# Altium schematic sheet IMX273.SchDoc
size A2; Organization: Altium Limited; Address1: L3, 12a Rodborough Rd; Address2: Frenchs Forest; Address3: NSW; Address4: Australia 2086
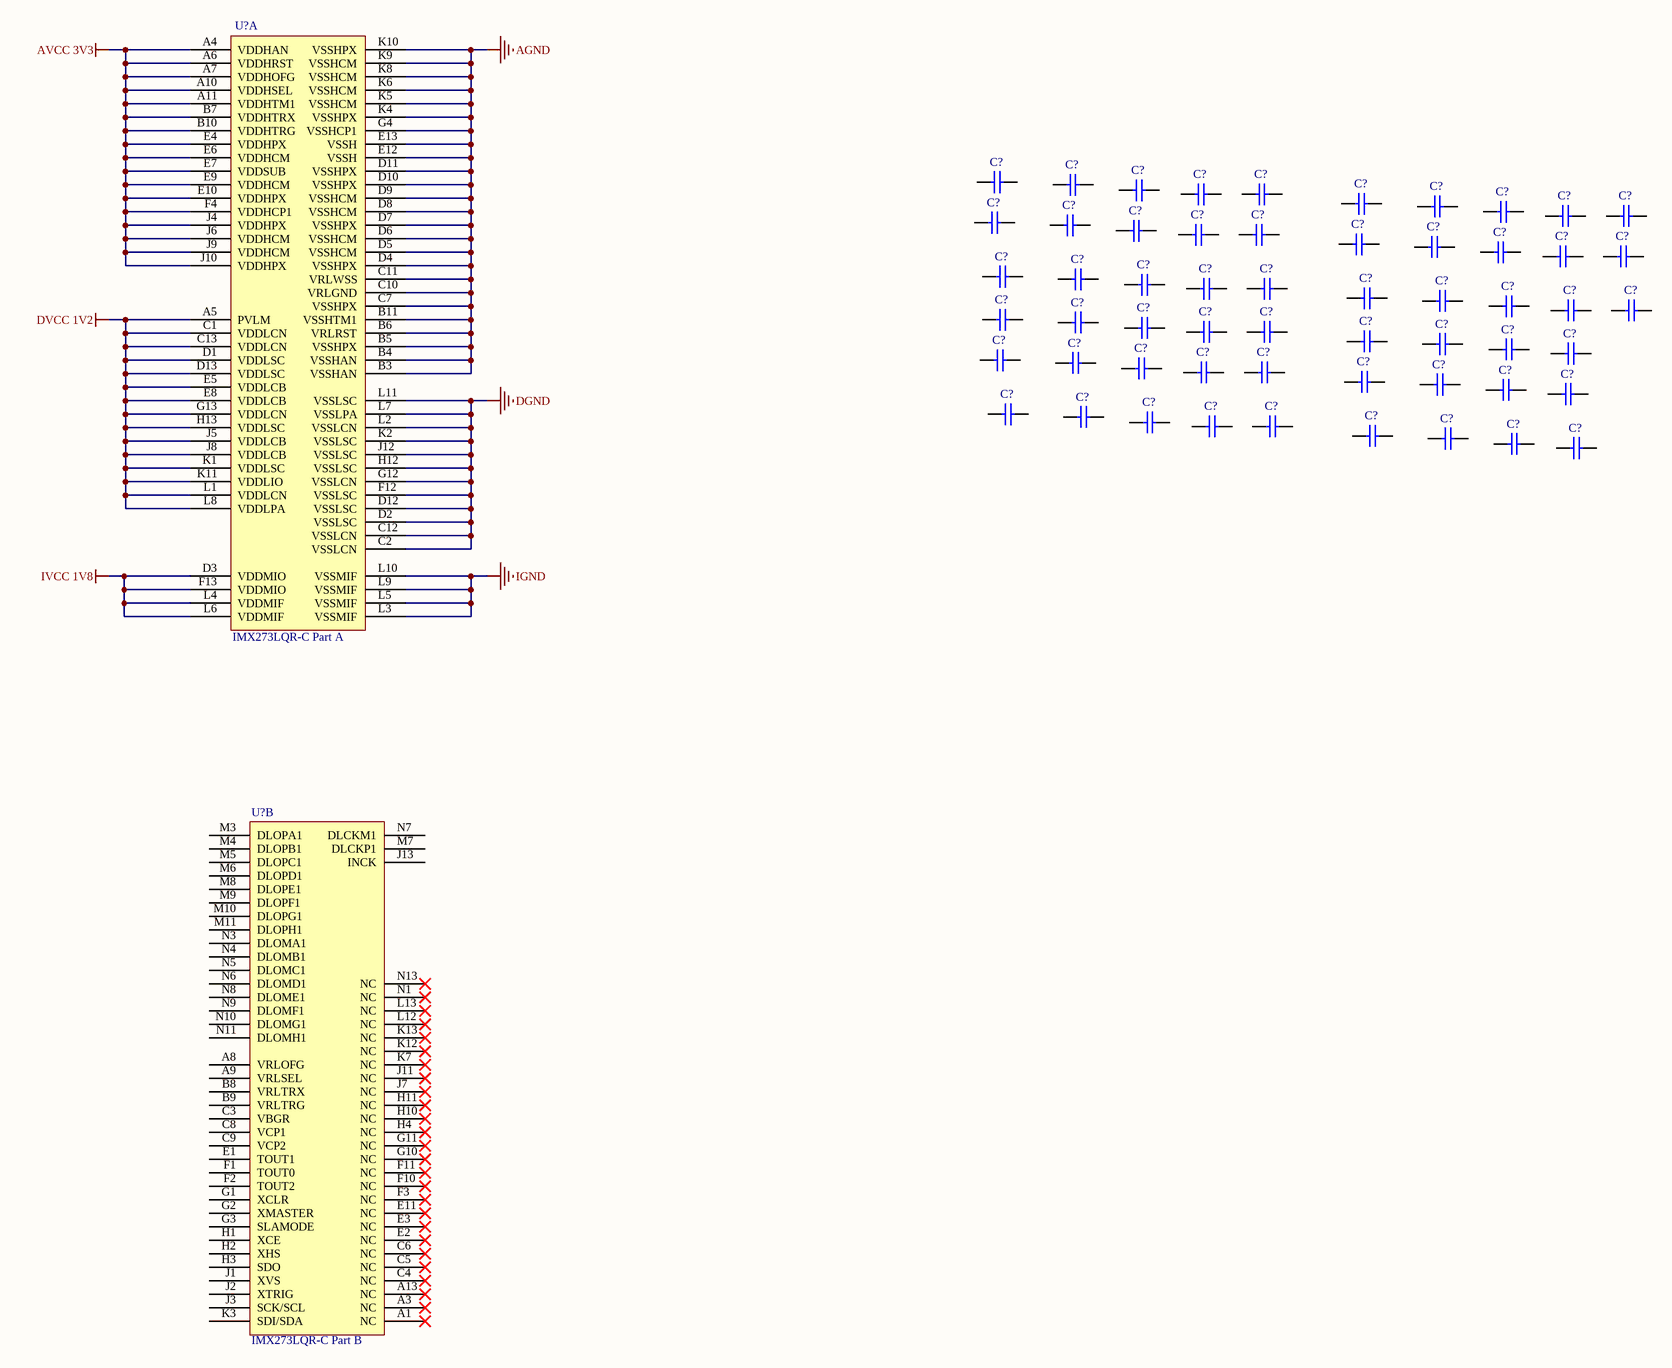
[diagram p0: IMX273.SchDoc]

## Parts
(Parts that share a designator on the sheet are numbered #1, #2 ... from top to bottom, then left to right.)
C?#1  CL05A106MQ5NUNC  [0402_C]  (value not drawn)
C?#2  CL05A106MQ5NUNC  [0402_C]  (value not drawn)
C?#3  CL05A106MQ5NUNC  [0402_C]  (value not drawn)
C?#4  CL05A106MQ5NUNC  [0402_C]  (value not drawn)
C?#5  CL05A106MQ5NUNC  [0402_C]  (value not drawn)
C?#6  CL05A106MQ5NUNC  [0402_C]  (value not drawn)
C?#7  CL05A106MQ5NUNC  [0402_C]  (value not drawn)
C?#8  CL05A106MQ5NUNC  [0402_C]  (value not drawn)
C?#9  CL05A106MQ5NUNC  [0402_C]  (value not drawn)
C?#10  CL05A106MQ5NUNC  [0402_C]  (value not drawn)
C?#11  CL05A106MQ5NUNC  [0402_C]  (value not drawn)
C?#12  CL05A106MQ5NUNC  [0402_C]  (value not drawn)
C?#13  CL05A106MQ5NUNC  [0402_C]  (value not drawn)
C?#14  CL05A106MQ5NUNC  [0402_C]  (value not drawn)
C?#15  CL05A106MQ5NUNC  [0402_C]  (value not drawn)
C?#16  CL05A106MQ5NUNC  [0402_C]  (value not drawn)
C?#17  CL05A106MQ5NUNC  [0402_C]  (value not drawn)
C?#18  CL05A106MQ5NUNC  [0402_C]  (value not drawn)
C?#19  CL05A106MQ5NUNC  [0402_C]  (value not drawn)
C?#20  CL05A106MQ5NUNC  [0402_C]  (value not drawn)
C?#21  CL05A106MQ5NUNC  [0402_C]  (value not drawn)
C?#22  CL05A106MQ5NUNC  [0402_C]  (value not drawn)
C?#23  CL05A106MQ5NUNC  [0402_C]  (value not drawn)
C?#24  CL05A106MQ5NUNC  [0402_C]  (value not drawn)
C?#25  CL05A106MQ5NUNC  [0402_C]  (value not drawn)
C?#26  CL05A106MQ5NUNC  [0402_C]  (value not drawn)
C?#27  CL05A106MQ5NUNC  [0402_C]  (value not drawn)
C?#28  CL05A106MQ5NUNC  [0402_C]  (value not drawn)
C?#29  CL05A106MQ5NUNC  [0402_C]  (value not drawn)
C?#30  CL05A106MQ5NUNC  [0402_C]  (value not drawn)
C?#31  CL05A106MQ5NUNC  [0402_C]  (value not drawn)
C?#32  CL05A106MQ5NUNC  [0402_C]  (value not drawn)
C?#33  CL05A106MQ5NUNC  [0402_C]  (value not drawn)
C?#34  CL05A106MQ5NUNC  [0402_C]  (value not drawn)
C?#35  CL05A106MQ5NUNC  [0402_C]  (value not drawn)
C?#36  CL05A106MQ5NUNC  [0402_C]  (value not drawn)
C?#37  CL05A106MQ5NUNC  [0402_C]  (value not drawn)
C?#38  CL05A106MQ5NUNC  [0402_C]  (value not drawn)
C?#39  CL05A106MQ5NUNC  [0402_C]  (value not drawn)
C?#40  CL05A106MQ5NUNC  [0402_C]  (value not drawn)
C?#41  CL05A106MQ5NUNC  [0402_C]  (value not drawn)
C?#42  CL05A106MQ5NUNC  [0402_C]  (value not drawn)
C?#43  CL05A106MQ5NUNC  [0402_C]  (value not drawn)
C?#44  CL05A106MQ5NUNC  [0402_C]  (value not drawn)
C?#45  CL05A106MQ5NUNC  [0402_C]  (value not drawn)
C?#46  CL05A106MQ5NUNC  [0402_C]  (value not drawn)
C?#47  CL05A106MQ5NUNC  [0402_C]  (value not drawn)
C?#48  CL05A106MQ5NUNC  [0402_C]  (value not drawn)
C?#49  CL05A106MQ5NUNC  [0402_C]  (value not drawn)
C?#50  CL05A106MQ5NUNC  [0402_C]  (value not drawn)
C?#51  CL05A106MQ5NUNC  [0402_C]  (value not drawn)
C?#52  CL05A106MQ5NUNC  [0402_C]  (value not drawn)
C?#53  CL05A106MQ5NUNC  [0402_C]  (value not drawn)
C?#54  CL05A106MQ5NUNC  [0402_C]  (value not drawn)
C?#55  CL05A106MQ5NUNC  [0402_C]  (value not drawn)
C?#56  CL05A106MQ5NUNC  [0402_C]  (value not drawn)
C?#57  CL05A106MQ5NUNC  [0402_C]  (value not drawn)
U?#1  IMX273LQR-C  [LGA138C100P13X13_1400X1400X202]  (value not drawn)  (part A of 2)
U?#2  IMX273LQR-C  [LGA138C100P13X13_1400X1400X202]  (value not drawn)  (part B of 2)

## Nets
AGND: U?#1.B3(VSSHAN) U?#1.B4(VSSHAN) U?#1.B5(VSSHPX) U?#1.B6(VRLRST) U?#1.B11(VSSHTM1) U?#1.C7(VSSHPX) U?#1.C10(VRLGND) U?#1.C11(VRLWSS) U?#1.D4(VSSHPX) U?#1.D5(VSSHCM) U?#1.D6(VSSHCM) U?#1.D7(VSSHPX) U?#1.D8(VSSHCM) U?#1.D9(VSSHCM) U?#1.D10(VSSHPX) U?#1.D11(VSSHPX) U?#1.E12(VSSH) U?#1.E13(VSSH) U?#1.G4(VSSHCP1) U?#1.K4(VSSHPX) U?#1.K5(VSSHCM) U?#1.K6(VSSHCM) U?#1.K8(VSSHCM) U?#1.K9(VSSHCM) U?#1.K10(VSSHPX)
AVCC 3V3: U?#1.A4(VDDHAN) U?#1.A6(VDDHRST) U?#1.A7(VDDHOFG) U?#1.A10(VDDHSEL) U?#1.A11(VDDHTM1) U?#1.B7(VDDHTRX) U?#1.B10(VDDHTRG) U?#1.E4(VDDHPX) U?#1.E6(VDDHCM) U?#1.E7(VDDSUB) U?#1.E9(VDDHCM) U?#1.E10(VDDHPX) U?#1.F4(VDDHCP1) U?#1.J4(VDDHPX) U?#1.J6(VDDHCM) U?#1.J9(VDDHCM) U?#1.J10(VDDHPX)
DGND: U?#1.C2(VSSLCN) U?#1.C12(VSSLCN) U?#1.D2(VSSLSC) U?#1.D12(VSSLSC) U?#1.F12(VSSLSC) U?#1.G12(VSSLCN) U?#1.H12(VSSLSC) U?#1.J12(VSSLSC) U?#1.K2(VSSLSC) U?#1.L2(VSSLCN) U?#1.L7(VSSLPA) U?#1.L11(VSSLSC)
DVCC 1V2: U?#1.A5(PVLM) U?#1.C1(VDDLCN) U?#1.C13(VDDLCN) U?#1.D1(VDDLSC) U?#1.D13(VDDLSC) U?#1.E5(VDDLCB) U?#1.E8(VDDLCB) U?#1.G13(VDDLCN) U?#1.H13(VDDLSC) U?#1.J5(VDDLCB) U?#1.J8(VDDLCB) U?#1.K1(VDDLSC) U?#1.K11(VDDLIO) U?#1.L1(VDDLCN) U?#1.L8(VDDLPA)
IGND: U?#1.L3(VSSMIF) U?#1.L5(VSSMIF) U?#1.L9(VSSMIF) U?#1.L10(VSSMIF)
IVCC 1V8: U?#1.D3(VDDMIO) U?#1.F13(VDDMIO) U?#1.L4(VDDMIF) U?#1.L6(VDDMIF)

Not connected (* = marked no-connect by the designer): C?#1 1 2; C?#2 1 2; C?#3 1 2; C?#4 1 2; C?#5 1 2; C?#6 1 2; C?#7 1 2; C?#8 1 2; C?#9 1 2; C?#10 1 2; C?#11 1 2; C?#12 1 2; C?#13 1 2; C?#14 1 2; C?#15 1 2; C?#16 1 2; C?#17 1 2; C?#18 1 2; C?#19 1 2; C?#20 1 2; C?#21 1 2; C?#22 1 2; C?#23 1 2; C?#24 1 2; C?#25 1 2; C?#26 1 2; C?#27 1 2; C?#28 1 2; C?#29 1 2; C?#30 1 2; C?#31 1 2; C?#32 1 2; C?#33 1 2; C?#34 1 2; C?#35 1 2; C?#36 1 2; C?#37 1 2; C?#38 1 2; C?#39 1 2; C?#40 1 2; C?#41 1 2; C?#42 1 2; C?#43 1 2; C?#44 1 2; C?#45 1 2; C?#46 1 2; C?#47 1 2; C?#48 1 2; C?#49 1 2; C?#50 1 2; C?#51 1 2; C?#52 1 2; C?#53 1 2; C?#54 1 2; C?#55 1 2; C?#56 1 2; C?#57 1 2; U?#2 A1(NC)* A3(NC)* A8(VRLOFG) A9(VRLSEL) A13(NC)* B8(VRLTRX) B9(VRLTRG) C3(VBGR) C4(NC)* C5(NC)* C6(NC)* C8(VCP1) C9(VCP2) E1(TOUT1) E2(NC)* E3(NC)* E11(NC)* F1(TOUT0) F2(TOUT2) F3(NC)* F10(NC)* F11(NC)* G1(XCLR) G2(XMASTER) G3(SLAMODE) G10(NC)* G11(NC)* H1(XCE) H2(XHS) H3(SDO) H4(NC)* H10(NC)* H11(NC)* J1(XVS) J2(XTRIG) J3(SCK/SCL) J7(NC)* J11(NC)* J13(INCK) K3(SDI/SDA) K7(NC)* K12(NC)* K13(NC)* L12(NC)* L13(NC)* M3(DLOPA1) M4(DLOPB1) M5(DLOPC1) M6(DLOPD1) M7(DLCKP1) M8(DLOPE1) M9(DLOPF1) M10(DLOPG1) M11(DLOPH1) N1(NC)* N3(DLOMA1) N4(DLOMB1) N5(DLOMC1) N6(DLOMD1) N7(DLCKM1) N8(DLOME1) N9(DLOMF1) N10(DLOMG1) N11(DLOMH1) N13(NC)*

## Notes on the sheet
- Title
- Size:
- Date:
- A4
- Author:
- Time:
- (in symbol IMX273LQR-C, part A) IMX273LQR-C Part A
- (in symbol IMX273LQR-C, part B) IMX273LQR-C Part B

## Library data of the parts
C?#1-C?#57 = CL05A106MQ5NUNC: 0402贴片电容; Manufacturer: SAMSUNG(三星); Add into BOM: yes; Value: 10uF; Tolerance: ±20%; Voltage Rated: 6.3V; Temperature Coefficient: X5R; Symbol: CL05A106MQ5NUNC; Device: CL05A106MQ5NUNC; LCSC Part Name: 10uF ±20% 6.3V; Supplier Part: C15525; Manufacturer Part: CL05A106MQ5NUNC; Supplier Footprint: 0402; JLCPCB Part Class: Basic Part; Datasheet: https://atta.szlcsc.com/upload/public/pdf/source/20220823/2B02EE04F8F211D38A52DCB16EB6BEBA.pdf; Supplier: LCSC; Convert to PCB: yes
U?#1 U?#2 = IMX273LQR-C: SONY CMOS传感器; Manufacturer: Sony(索尼); Add into BOM: yes; Symbol: IMX273LQR-C; Device: IMX273LQR-C; LCSC Part Name: IMX273LQR-C; Supplier Part: C5249315; Manufacturer Part: IMX273LQR-C; Supplier Footprint: LGA-138; JLCPCB Part Class: Extended Part; Datasheet: https://atta.szlcsc.com/upload/public/pdf/source/20230906/B553CB6F46D914DB518133BEFA776B57.pdf; Supplier: LCSC; Convert to PCB: yes